# EAGLE board ADCS Motherboard (EAGLE 9.6.2)
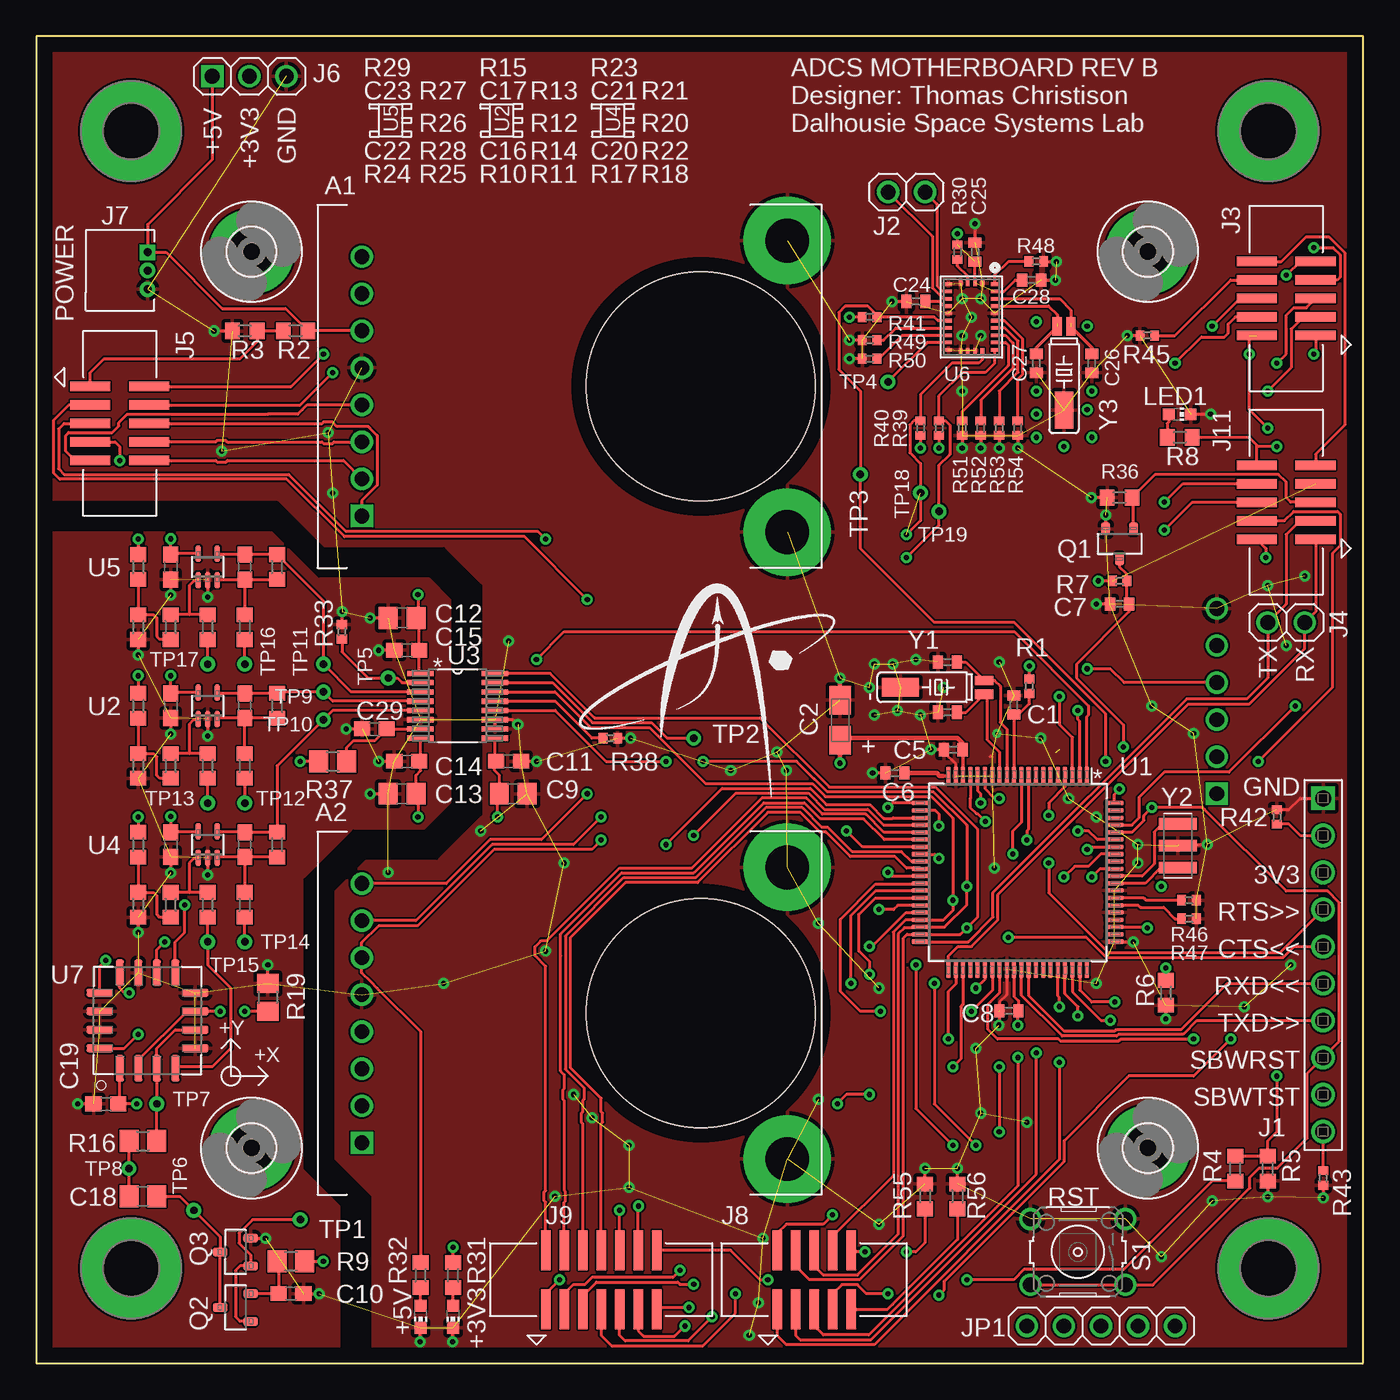
[diagram p4: board, top side]
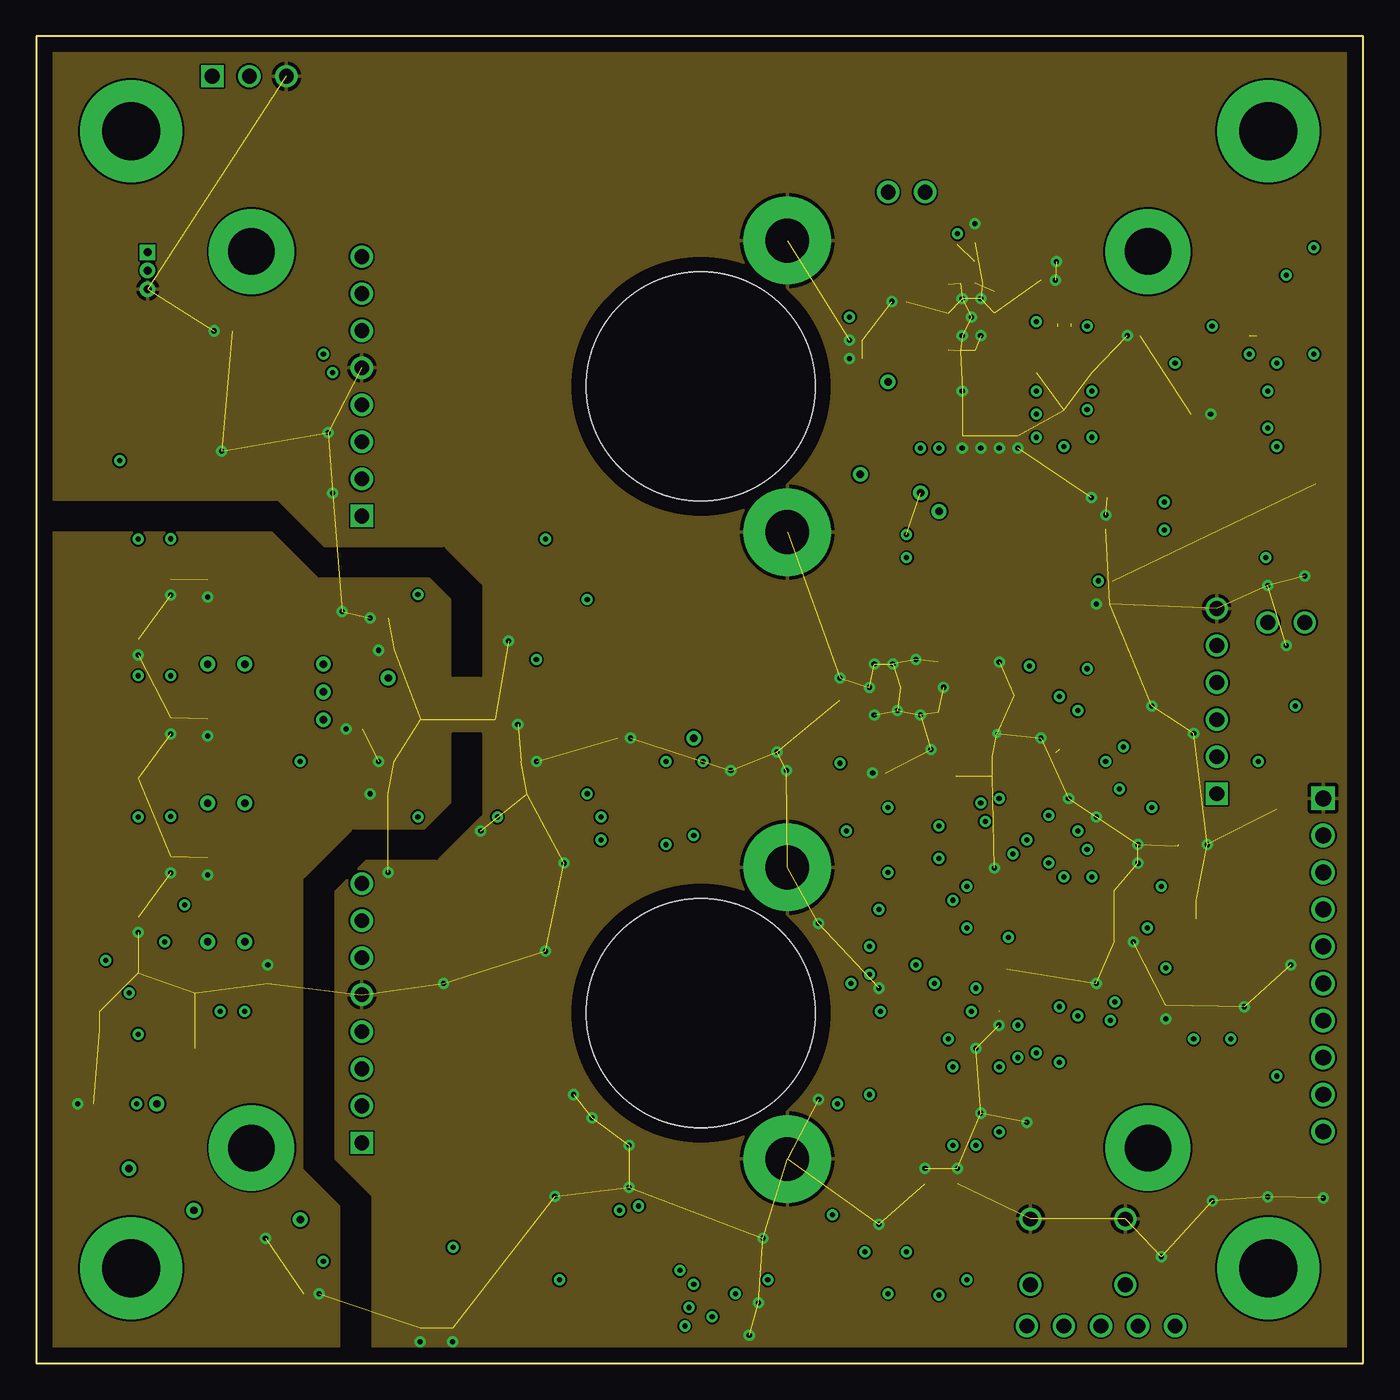
[diagram p5: board, inner layer GND]
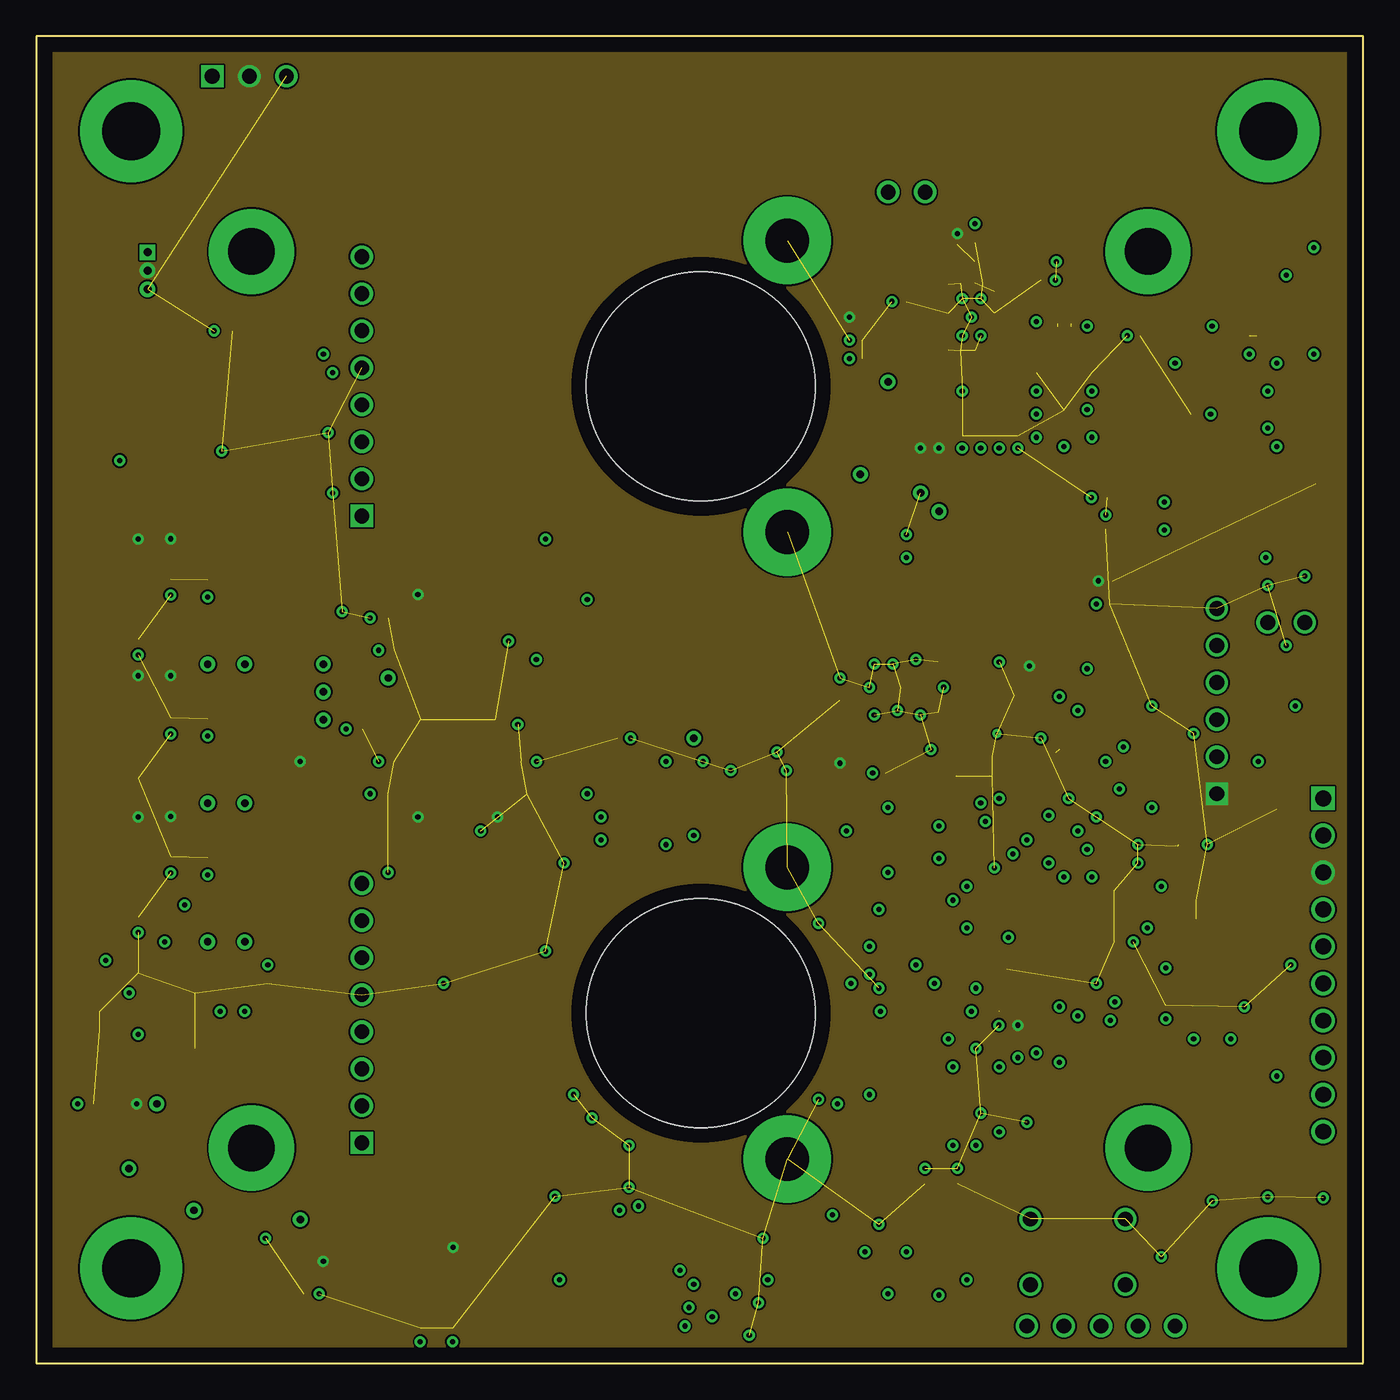
[diagram p6: board, inner layer PWR]
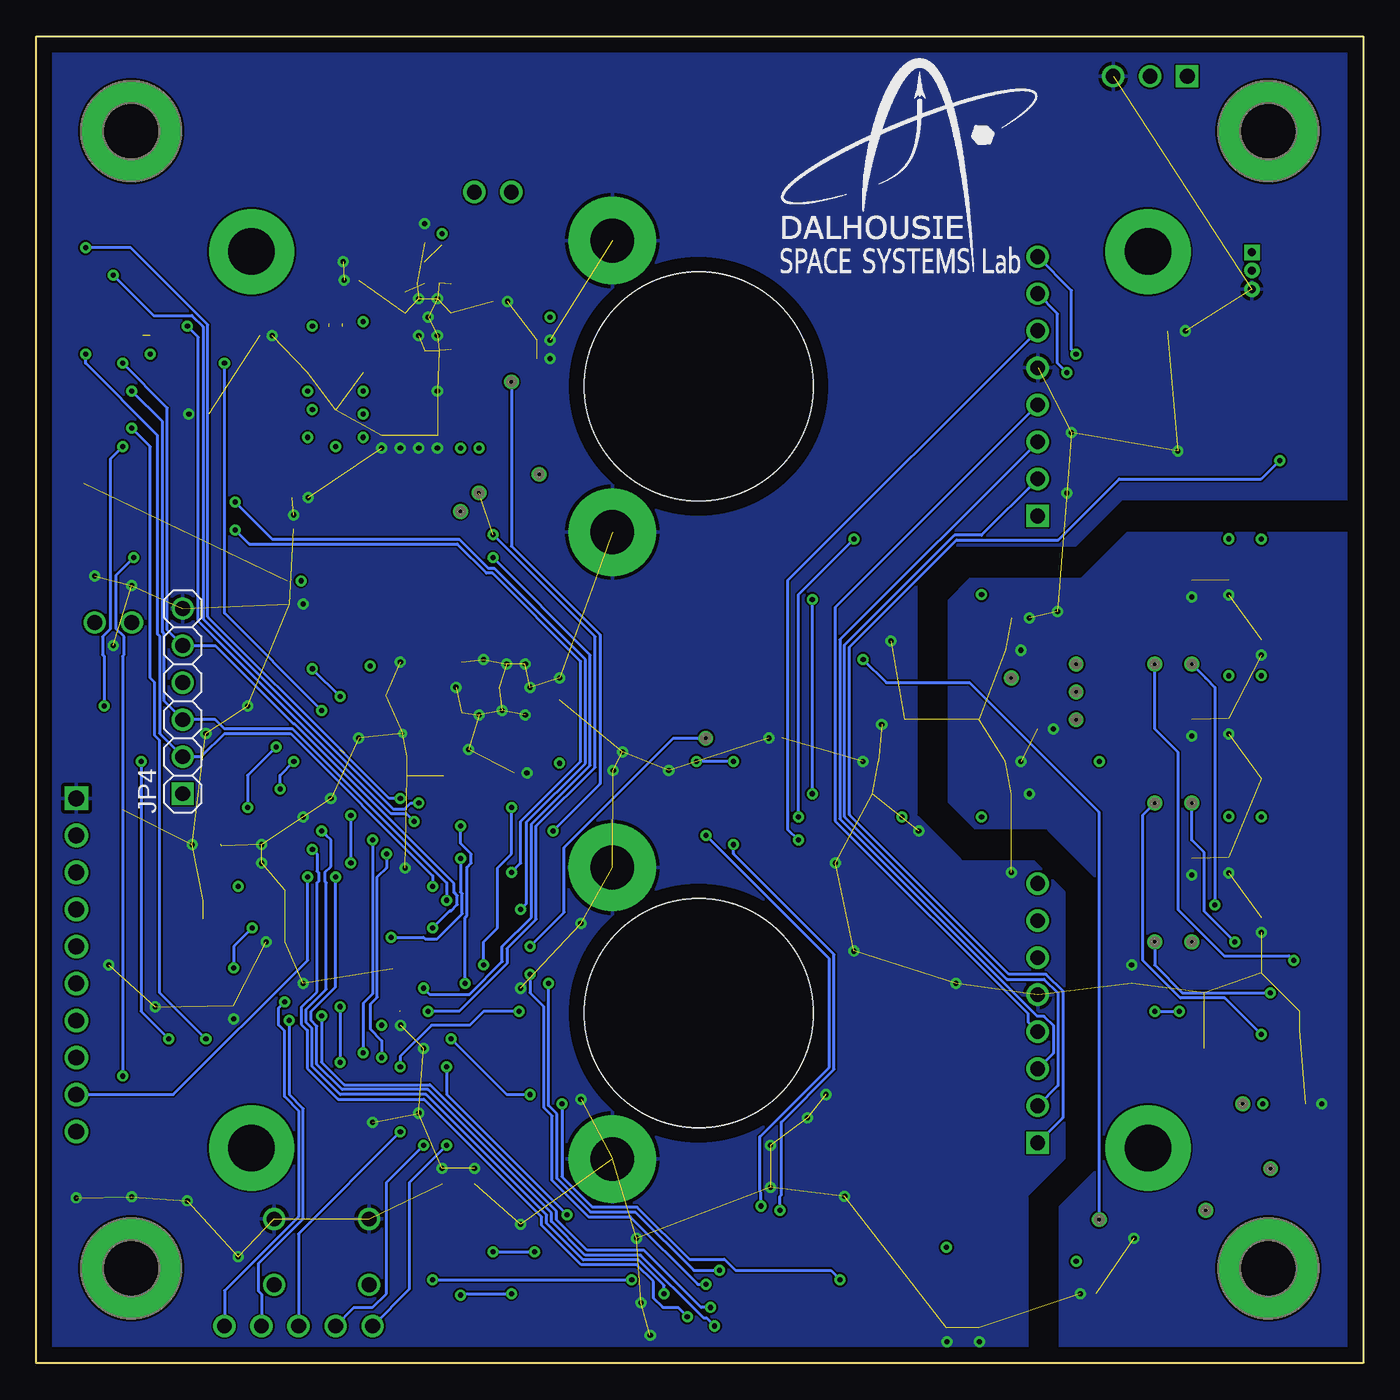
[diagram p7: board, bottom side, seen from below]

Size 91 x 91 mm. Coordinates in mm from the lower left corner, seen from the top.
Outline: 0,0 91,0 91,91 0,91 0,0
Copper layers (1+2*15+16): Top 0.035mm / dielectric 0.2mm / GND 0.035mm / dielectric 1.03mm / PWR 0.035mm / dielectric 0.2mm / Bottom 0.035mm
Design rules "default *": minimum track width 6mil, minimum drill 0.2mm, track to track 5mil, track to pad 0.2mm, pad to pad 5mil, via to via 0.54mm, smd to smd 6mil, copper to edge 40mil, drill to drill 0.54mm, minimum pad ring 10mil, minimum via ring 8mil, stop-mask expansion 4mil, vias tented up to drill 0mil, thermal gap 10mil
Net classes: 1 Ground: width 0.203 mm, drill 0.305 mm, clearance 0.152 mm to class 0, clearance 0.152 mm; 2 Power: width 0.203 mm, drill 0.305 mm, clearance 0.152 mm to class 0, clearance 0.152 mm to class 1, clearance 0.152 mm

## Footprints (pad centres in the part's own frame; a part is rotated, then mirrored left to right if it is on the bottom)
ARDUCAM = drill 1.016 square: 1 -29.18,-18.89 | drill 1.016: 2 -29.18,-16.35; 3 -29.18,-13.81; 4 -29.18,-11.27; 5 -29.18,-8.73; 6 -29.18,-6.19; 7 -29.18,-3.65; 8 -29.18,-1.11 | drill 3 pad 6: P$1 0,0; P$2 0,-20 | hole 15.7: -5.917,-10
C0402 = smd 0.7 x 0.9: 1 -0.65,0; 2 0.65,0
A/3216-18R = smd 1.95 x 1.5: + 1.375,0; - -1.375,0
C0805 = smd 1.3 x 1.5: 1 -0.95,0; 2 0.95,0
C0603 = smd 1.1 x 1: 1 -0.85,0; 2 0.85,0
3,2-PAD = drill 3.2 pad 5.842: B3,2 0,0
HDRV10W66P254_10X1_2540X254H858 = drill 1.08 pad 1.62 square: 1 0,0 | drill 1.08 pad 1.62: 2 2.54,0; 3 5.08,0; 4 7.62,0; 5 10.16,0; 6 12.7,0; 7 15.24,0; 8 17.78,0; 9 20.32,0; 10 22.86,0
1X02 = drill 1.016: 1 -1.27,0; 2 1.27,0
CNC_3221-10-0300-00 = smd 0.65 x 2.76: 1 -2.54,-2.02; 2 -2.54,2.02; 3 -1.27,-2.02; 4 -1.27,2.02; 5 0,-2.02; 6 0,2.02; 7 1.27,-2.02; 8 1.27,2.02; 9 2.54,-2.02; 10 2.54,2.02
1X03 = drill 1.016 square: 1 -2.54,0 | drill 1.016: 2 0,0; 3 2.54,0
TE-1734829-3 = drill 0.55 square: 1 0,0 | drill 0.55: 2 -1.25,0; 3 -2.54,0
CNC_3221-14-0300-00 = smd 0.65 x 2.76: 1 -3.81,-2.02; 2 -3.81,2.02; 3 -2.54,-2.02; 4 -2.54,2.02; 5 -1.27,-2.02; 6 -1.27,2.02; 7 0,-2.02; 8 0,2.02; 9 1.27,-2.02; 10 1.27,2.02; 11 2.54,-2.02; 12 2.54,2.02; 13 3.81,-2.02; 14 3.81,2.02
1X05 = drill 1.016: 1 -5.08,0; 2 -2.54,0; 3 0,0; 4 2.54,0; 5 5.08,0
1X06 = drill 1.016 square: 1 -6.35,0 | drill 1.016: 2 -3.81,0; 3 -1.27,0; 4 1.27,0; 5 3.81,0; 6 6.35,0
CHIP-LED0603 = smd 0.8 x 0.8: A 0,-0.75; C 0,0.75
MTGP700H400 = drill 4 pad 7: 1 0,0
SOT23-3P95_230X110L20X43N_PMV16XN = smd 0.61 x 0.87: 1 -0.95,-1.02; 2 0.95,-1.02; 3 0,1.02
SOT23-3P95_237X112L25X40N_MICRO3 = smd 0.61 x 0.98: 1 -0.95,-1.035; 2 0.95,-1.035; 3 0,1.035
R0402 = smd 0.6 x 0.7: 1 -0.5,0; 2 0.5,0
R0603 = smd 1 x 1.1: 1 -0.85,0; 2 0.85,0
R0805 = smd 1.3 x 1.5: 1 -0.95,0; 2 0.95,0
B3F-10XX = drill 1.016: 1 -3.251,2.261; 2 3.251,2.261; 3 -3.251,-2.261; 4 3.251,-2.261
TP_P76H50 = drill 0.51 pad 0.762: 1 0,0
QFP80P50_1400X1400X160L60X22N = smd 0.3 x 1.26: 1 -4.75,-6.63; 2 -4.25,-6.63; 3 -3.75,-6.63; 4 -3.25,-6.63; 5 -2.75,-6.63; 6 -2.25,-6.63; 7 -1.75,-6.63; 8 -1.25,-6.63; 9 -0.75,-6.63; 10 -0.25,-6.63; 11 0.25,-6.63; 12 0.75,-6.63; 13 1.25,-6.63; 14 1.75,-6.63; 15 2.25,-6.63; 16 2.75,-6.63; 17 3.25,-6.63; 18 3.75,-6.63; 19 4.25,-6.63; 20 4.75,-6.63; 41 4.75,6.63; 42 4.25,6.63; 43 3.75,6.63; 44 3.25,6.63; 45 2.75,6.63; 46 2.25,6.63; 47 1.75,6.63; 48 1.25,6.63; 49 0.75,6.63; 50 0.25,6.63; 51 -0.25,6.63; 52 -0.75,6.63; 53 -1.25,6.63; 54 -1.75,6.63; 55 -2.25,6.63; 56 -2.75,6.63; 57 -3.25,6.63; 58 -3.75,6.63; 59 -4.25,6.63; 60 -4.75,6.63 | smd 1.26 x 0.3: 21 6.63,-4.75; 22 6.63,-4.25; 23 6.63,-3.75; 24 6.63,-3.25; 25 6.63,-2.75; 26 6.63,-2.25; 27 6.63,-1.75; 28 6.63,-1.25; 29 6.63,-0.75; 30 6.63,-0.25; 31 6.63,0.25; 32 6.63,0.75; 33 6.63,1.25; 34 6.63,1.75; 35 6.63,2.25; 36 6.63,2.75; 37 6.63,3.25; 38 6.63,3.75; 39 6.63,4.25; 40 6.63,4.75; 61 -6.63,4.75; 62 -6.63,4.25; 63 -6.63,3.75; 64 -6.63,3.25; 65 -6.63,2.75; 66 -6.63,2.25; 67 -6.63,1.75; 68 -6.63,1.25; 69 -6.63,0.75; 70 -6.63,0.25; 71 -6.63,-0.25; 72 -6.63,-0.75; 73 -6.63,-1.25; 74 -6.63,-1.75; 75 -6.63,-2.25; 76 -6.63,-2.75; 77 -6.63,-3.25; 78 -6.63,-3.75; 79 -6.63,-4.25; 80 -6.63,-4.75
SC70-5P65_210X110L36X22N = smd 0.38 x 1.09: 1 -0.65,-0.91; 2 0,-0.91; 3 0.65,-0.91; 4 0.65,0.91; 5 -0.65,0.91
DBQ16 = smd 1.803 x 0.356: 1 -2.553,2.223; 2 -2.553,1.587; 3 -2.553,0.953; 4 -2.553,0.318; 5 -2.553,-0.318; 6 -2.553,-0.953; 7 -2.553,-1.587; 8 -2.553,-2.223; 9 2.553,-2.223; 10 2.553,-1.587; 11 2.553,-0.953; 12 2.553,-0.318; 13 2.553,0.318; 14 2.553,0.953; 15 2.553,1.587; 16 2.553,2.223
BNO055 = smd 0.25 x 0.475: 1 -2.25,1.562; 6 -2.25,-1.562; 7 -1.75,-1.562; 8 -1.25,-1.562; 9 -0.75,-1.562; 10 -0.25,-1.562; 11 0.25,-1.562; 12 0.75,-1.562; 13 1.25,-1.562; 14 1.75,-1.562; 15 2.25,-1.562; 20 2.25,1.562; 21 1.75,1.562; 22 1.25,1.562; 23 0.75,1.562; 24 0.25,1.562; 25 -0.25,1.562; 26 -0.75,1.562; 27 -1.25,1.562; 28 -1.75,1.562 | smd 0.375 x 0.25: 2 -2.312,0.75; 3 -2.312,0.25; 4 -2.312,-0.25; 5 -2.312,-0.75; 16 2.312,-0.75; 17 2.312,-0.25; 18 2.312,0.25; 19 2.312,0.75
LCCS16P127_736X736X279L127X50N = smd 0.56 x 1.83: 1 -1.905,-3.275; 2 -0.635,-3.275; 3 0.635,-3.275; 4 1.905,-3.275; 9 1.905,3.275; 10 0.635,3.275; 11 -0.635,3.275; 12 -1.905,3.275 | smd 1.83 x 0.56: 5 3.275,-1.905; 6 3.275,-0.635; 7 3.275,0.635; 8 3.275,1.905; 13 -3.275,1.905; 14 -3.275,0.635; 15 -3.275,-0.635; 16 -3.275,-1.905
MS3V-T1R = smd 0.635 x 1.27: P1 -0.47,-4.43; P2 0.47,-4.43 | smd 1.27 x 2.54: P3 0,1.3
MURATA-FILTER_CSTCR = smd 0.8 x 2.6: 1 -1.5,0; 2 0,0; 3 1.5,0

## Placement (x,y rotation side)
A1  ARDUCAM_OV5642  [ARDUCAM]  51.5,77 0 top
A2  ARDUCAM_OV5642  [ARDUCAM]  51.5,34 0 top
C1  100n  [C0402]  67.04,45.14 90 top
C2  10u  [A/3216-18R]  55.13,44.09 270 top
C3  12p  [C0402]  62.5,48.08 0 top
C4  12p  [C0402]  62.5,44.64 0 top
C5  100n  [C0402]  62.89,42.08 0 top
C6  470n  [C0402]  58.89,40.47 0 top
C7  1n  [C0402]  74.3,52.07 180 top
C8  100n  [C0402]  66.71,24.17 180 top
C9  1u  [C0805]  32.7,39.05 0 top
C10  1u  [C0603]  17.46,4.76 180 top
C11  0.1u  [C0603]  32.38,41.27 0 top
C12  1u  [C0805]  25.08,51.12 180 top
C13  1u  [C0805]  25.08,39.05 180 top
C14  0.1u  [C0603]  25.4,41.27 180 top
C15  0.1u  [C0603]  25.4,48.9 180 top
C16  0.1u  [C0603]  9.21,45.09 270 top
C17  1n  [C0603]  14.29,45.09 90 top
C18  0.1u  [C0805]  7.3,11.43 180 top
C19  0.1u  [C0603]  4.76,17.78 180 top
C20  0.1u  [C0603]  9.21,35.56 270 top
C21  1n  [C0603]  14.29,35.56 90 top
C22  0.1u  [C0603]  9.21,54.61 270 top
C23  1n  [C0603]  14.29,54.61 90 top
C24  1u  [C0402]  60.33,72.82 0 top
C25  0.1u  [C0402]  64.39,76.2 270 top
C26  22p  [C0402]  72.39,68.58 90 top
C27  22p  [C0402]  68.58,68.58 90 top
C28  0.1u  [C0402]  68.26,74.3 180 top
C29  0.1u  [C0603]  23.18,43.5 180 top
H1  MOUNT-PAD-ROUND3.2  [3,2-PAD]  14.75,76.25 0 top
H2  MOUNT-PAD-ROUND3.2  [3,2-PAD]  76.25,76.25 0 top
H3  MOUNT-PAD-ROUND3.2  [3,2-PAD]  76.25,14.75 0 top
H4  MOUNT-PAD-ROUND3.2  [3,2-PAD]  14.75,14.75 0 top
J1  HDR_10_EZFET_DEBUGGER  [HDRV10W66P254_10X1_2540X254H858]  88.27,38.73 270 top
J2  [1X02]  59.69,80.33 180 top
J3  CNC_3221-10-0300-00  [CNC_3221-10-0300-00]  85.72,73.03 90 top
J4  [1X02]  85.72,50.8 0 top
J5  CNC_3221-10-0300-00  [CNC_3221-10-0300-00]  5.71,64.45 270 top
J6  [1X03]  14.61,88.27 0 top
J7  TE-1734829-3  [TE-1734829-3]  7.62,76.2 90 top
J8  CNC_3221-10-0300-00  [CNC_3221-10-0300-00]  53.34,5.71 0 top
J9  CNC_3221-14-0300-00  [CNC_3221-14-0300-00]  38.73,5.71 0 top
J11  CNC_3221-10-0300-00  [CNC_3221-10-0300-00]  85.72,59.05 90 top
JP1  [1X05]  73.03,2.54 0 top
JP4  [1X06]  80.96,45.4 90 bottom
LED1  [CHIP-LED0603]  78.42,65.09 270 top
LED2  [CHIP-LED0603]  28.57,3.17 180 top
LED3  [CHIP-LED0603]  26.35,3.17 180 top
MH1  MTGP700H400  [MTGP700H400]  6.5,6.5 0 top
MH2  MTGP700H400  [MTGP700H400]  84.5,6.5 0 top
MH3  MTGP700H400  [MTGP700H400]  84.5,84.5 0 top
MH4  MTGP700H400  [MTGP700H400]  6.5,84.5 0 top
Q1  PMV16XN  [SOT23-3P95_230X110L20X43N_PMV16XN]  74.3,56.2 180 top
Q2  IRLML6246TRPBF  [SOT23-3P95_237X112L25X40N_MICRO3]  13.65,3.81 90 top
Q3  IRLML2246TRPBF  [SOT23-3P95_237X112L25X40N_MICRO3]  13.65,7.62 90 top
R1  0R  [R0402]  68.11,46.43 90 top
R2  1k  [R0603]  17.78,70.8 0 top
R3  2k  [R0603]  14.29,70.8 0 top
R4  1k  [R0603]  82.23,13.34 270 top
R5  2k  [R0603]  84.45,13.34 90 top
R6  1M  [R0603]  77.47,25.4 90 top
R7  47k  [R0402]  74.3,53.66 180 top
R8  470R  [R0603]  78.42,63.5 180 top
R9  200R  [R0805]  17.46,6.99 0 top
R10  1k  [R0603]  6.99,45.09 270 top
R11  1k  [R0603]  6.99,40.96 270 top
R12  5.6k  [R0603]  11.75,40.96 270 top
R13  5.6k  [R0603]  14.29,40.96 270 top
R14  1.37M  [R0603]  9.21,40.96 90 top
R15  1.37M  [R0603]  16.51,45.09 270 top
R16  1R  [R0805]  7.3,15.24 0 top
R17  1k  [R0603]  6.99,35.56 270 top
R18  1k  [R0603]  6.99,31.43 270 top
R19  5.1M  [R0805]  15.88,25.08 270 top
R20  5.6k  [R0603]  11.75,31.43 270 top
R21  5.6k  [R0603]  14.29,31.43 270 top
R22  1.37M  [R0603]  9.21,31.43 90 top
R23  1.37M  [R0603]  16.51,35.56 270 top
R24  1k  [R0603]  6.99,54.61 270 top
R25  1k  [R0603]  6.99,50.48 270 top
R26  5.6k  [R0603]  11.75,50.48 270 top
R27  5.6k  [R0603]  14.29,50.48 270 top
R28  1.37M  [R0603]  9.21,50.48 90 top
R29  1.37M  [R0603]  16.51,54.61 270 top
R30  10k  [R0402]  63.18,76.2 90 top
R31  470R  [R0603]  28.57,6.03 270 top
R32  750R  [R0603]  26.35,6.03 270 top
R33  5.1M  [R0402]  20.95,50.16 270 top
R36  10k  [R0603]  74.3,59.37 0 top
R37  10k  [R0805]  20.32,41.27 0 top
R38  5.1M  [R0402]  39.37,42.86 180 top
R39  10k  [R0402]  61.91,64.14 270 top
R40  10k  [R0402]  60.64,64.14 270 top
R41  10k  [R0402]  57.15,71.75 180 top
R42  5.1M  [R0402]  85.09,37.47 90 top
R43  5.1M  [R0402]  88.27,12.7 270 top
R45  5.1M  [R0402]  76.2,70.48 180 top
R46  5.1M  [R0402]  79.06,31.75 0 top
R47  5.1M  [R0402]  79.06,30.48 0 top
R48  5.1M  [R0402]  68.58,75.56 180 top
R49  5.1M  [R0402]  57.15,70.17 0 top
R50  5.1M  [R0402]  57.15,68.9 0 top
R51  5.1M  [R0402]  63.5,64.14 90 top
R52  5.1M  [R0402]  64.77,64.14 90 top
R53  5.1M  [R0402]  66.04,64.14 90 top
R54  5.1M  [R0402]  67.31,64.14 90 top
R55  5.1M  [R0603]  60.96,11.43 90 top
R56  5.1M  [R0603]  63.18,11.43 270 top
S1  RST  [B3F-10XX]  71.44,7.62 180 top
TP1  TESTPOINT  [TP_P76H50]  18.1,9.84 90 top
TP2  TESTPOINT  [TP_P76H50]  45.09,42.86 270 top
TP3  TESTPOINT  [TP_P76H50]  56.52,60.96 90 top
TP4  TESTPOINT  [TP_P76H50]  58.42,67.31 90 top
TP5  TESTPOINT  [TP_P76H50]  24.13,46.99 0 top
TP6  TESTPOINT  [TP_P76H50]  10.79,10.48 0 top
TP7  TESTPOINT  [TP_P76H50]  8.26,17.78 0 top
TP8  TESTPOINT  [TP_P76H50]  6.35,13.34 0 top
TP9  TESTPOINT  [TP_P76H50]  19.68,46.04 0 top
TP10  TESTPOINT  [TP_P76H50]  19.68,44.13 0 top
TP11  TESTPOINT  [TP_P76H50]  19.68,47.94 0 top
TP12  TESTPOINT  [TP_P76H50]  14.29,38.42 0 top
TP13  TESTPOINT  [TP_P76H50]  11.75,38.42 0 top
TP14  TESTPOINT  [TP_P76H50]  14.29,28.89 0 top
TP15  TESTPOINT  [TP_P76H50]  11.75,28.89 0 top
TP16  TESTPOINT  [TP_P76H50]  14.29,47.94 0 top
TP17  TESTPOINT  [TP_P76H50]  11.75,47.94 0 top
TP18  TESTPOINT  [TP_P76H50]  60.64,59.69 0 top
TP19  TESTPOINT  [TP_P76H50]  61.91,58.42 0 top
U1  MSP430F5529IPN  [QFP80P50_1400X1400X160L60X22N]  67.31,33.66 180 top
U2  LMV321  [SC70-5P65_210X110L36X22N]  11.75,45.09 0 top
U3  ADS7841E_2K5  [DBQ16]  28.89,45.09 0 top
U4  LMV321  [SC70-5P65_210X110L36X22N]  11.75,35.56 0 top
U5  LMV321  [SC70-5P65_210X110L36X22N]  11.75,54.61 0 top
U6  [BNO055]  64.14,71.75 270 top
U7  HMC1053  [LCCS16P127_736X736X279L127X50N]  7.62,23.5 0 top
Y1  32.768kHz  [MS3V-T1R]  60.58,46.35 90 top
Y2  CSTCR4M00G15L99  [MURATA-FILTER_CSTCR]  78.3,35.48 270 top
Y3  32.768kHz  [MS3V-T1R]  70.48,66.67 180 top

## Tracks (layer width: path | path; a pad name or v marks a point on that pad's centre or on a via)
!CS!_CURR_SENSE_MTQR  (via drill 0.35)
  Top 0.203: J8.5 53.34,2.56 53.98,1.93 57.09,1.93 67.31,12.15 v67.31,20.95 | v66.99,34.92 66.99,36.51 67.56,37.08 U1.10
  Bottom 0.203: v66.99,34.92 66.99,33.97 67.61,33.35 67.61,25.09 68.07,24.64 68.07,22.87 67.31,22.11 v67.31,20.95
!CS!_CURR_SENSE_RW  (via drill 0.35)
  Top 0.203: J8.3 52.07,1.91 52.38,1.6 57.23,1.6 68.58,12.95 v68.58,21.27 | v67.94,35.88 67.94,36.51 68.06,36.63 U1.9
  Bottom 0.203: v67.94,35.88 67.94,25.32 68.58,24.68 v68.58,21.27
!CS!_HMC1053  (via drill 0.35)
  Top 0.203: v57.15,28.57 57.32,28.57 59.65,30.91 U1.36 | TP2.1 43.25,42.86 42.19,43.93 38.14,43.93 35.39,46.67 U3.15
  Bottom 0.203: v57.15,28.57 54.8,30.92 54.8,35.37 47.31,42.86 TP2.1
!CS!_SUN_X+  (via drill 0.35)  (1 unrouted)
  Top 0.203: U1.48 66.06,25.39 65.28,24.61 65.28,22.87 65.93,22.23 70.1,22.23 70.22,22.1 74.24,22.1 74.36,22.23 v79.38,22.23 | 83.19,70.48 v83.19,69.22 83.19,65.41 v84.45,64.14
  Bottom 0.203: v79.38,22.23 82.55,25.4 82.55,42.71 82.89,43.06 82.89,46.7 83.19,46.99 83.19,62.87 v84.45,64.14
!CS!_SUN_X-  (via drill 0.35)  (1 unrouted)
  Top 0.203: 65.01,40.24 U1.15 65.06,39.4 65.72,38.73 v66.04,38.73 | v87.63,76.52 88.92,76.52 89.43,76.02 89.43,74.5 89.22,74.3 J3.7
  Bottom 0.203: 66.67,38.73 v66.04,38.73 66.8,38.73 70.17,42.11 | 69.91,41.85 79.24,51.18 79.24,71.22 84.54,76.52 v87.63,76.52
!CS!_SUN_Y+  (via drill 0.35)
  Top 0.203: U1.2 71.56,44.01 71.44,44.13 v71.44,44.77 | v78.11,68.58 79.91,70.39 81.5,70.39 81.76,70.64 81.76,71.28 82.23,71.75 J3.4
  Bottom 0.203: v78.11,68.58 78.11,51.44 v71.44,44.77
!CS!_SUN_Y-  (via drill 0.35)
  Top 0.203: U1.16 64.56,39.26 64.77,39.05 v64.77,38.42 | v85.72,74.61 86.68,75.56 J3.9
  Bottom 0.203: v64.77,38.42 65.32,38.42 65.74,38 66.53,38 79.57,51.04 79.57,71.08 80.34,71.85 82.97,71.85 v85.72,74.61
!CS!_SUN_Z+  (via drill 0.35)
  Top 0.203: U1.3 71.06,42.92 70.17,43.81 v70.17,45.72 | v72.07,47.62 73.66,47.62 74.61,46.67 JP4.4
  Bottom 0.203: v72.07,47.62 v70.17,45.72
!CS!_SUN_Z-  (via drill 0.35)
  Top 0.203: J3.6 82.55,73.03 v80.64,71.12 | U1.17 64.06,38.74 64.04,38.72 64.04,38.11 64.47,37.68 64.55,37.68 v65.09,37.15
  Bottom 0.203: v65.09,37.15 65.61,37.67 66.67,37.67 79.9,50.91 79.9,70.37 v80.64,71.12
+3V3  (via drill 0.35)  (3 unrouted)
  Top 0.203: U2.5 9.27,45.99 C16.1 v9.21,47.15 | v6.99,37.47 R17.1 | v6.99,56.52 R24.1 | U5.5 9.25,55.52 9.21,55.56 C22.1 v9.21,56.54 | U3.8 26.34,41.37 C14.1 26.35,41.17 26.35,40.64 26.03,40.32 C13.1 26.16,38.92 v26.16,37.47 | v6.99,47.15 R10.1 | R9.2 v19.68,6.99 | R1.2 v68.11,47.81 | U3.1 26.25,47.4 C15.1 26.25,50.9 C12.1 26.16,51.25 v26.16,52.7 | C2.+ 55.13,42.6 | C8.1 67.36,24.84 67.06,25.15 U1.50 | U3.9 31.45,41.37 C11.1 31.43,41.17 31.43,40.64 31.75,40.32 C9.1 31.62,38.92 v31.62,37.47 | v9.21,37.49 C20.1 9.27,36.47 U4.5 | v67.33,23.18 67.33,24.11 67.31,24.13 | R7.2 v72.86,53.66 | C28.2 67.15,74.3 66.36,73.5 U6.28 | U6.3 C25.2 | v6.88,17.78 C19.1 5.71,17.88 U7.1 | R40.2 v60.64,62.75 | R39.2 v61.91,62.75 | R41.2 v55.77,71.75 | R30.2 v63.18,77.47 | R37.1 v18.09,41.27 | 28.68,6.99 R31.1 v28.57,7.94
  Top 0.254: C8.1 67.31,24.13 67.36,24.13 | 63.56,42.06 63.56,42.26 | U1.18 63.56,42.01
  Top 0.305: 63.56,42.06 C5.2 | 63.56,42.01 C5.2 | 55.13,42.6 v55.13,41.15 | C5.2 63.54,42.51 63.17,42.88 55.29,42.88 C2.+
  pour PWR (rank 6, no thermals): -4.45,93.98 -4.45,-3.81 95.25,-3.81 95.25,92.71 95.25,93.98
+5V  (via drill 0.35)
  Top 0.203: A1.6 18.94,70.81 | 18.94,70.81 R2.2 | R2.2 18.63,71.12 | 18.63,71.12 18.63,71.22 | 18.94,70.81 18.63,71.12 | J6.1 12.06,82.55 7.62,78.11 J7.1 8.89,76.2 12.75,72.34 17.09,72.34 R2.2 | v38.73,35.88 38.1,35.24 31.39,35.24 26.17,30.02 23.49,30.02 22.32,28.85 A2.6 22.32,26.77 22.96,26.14 23.38,25.71 26.35,22.74 R32.1
  Bottom 0.203: v38.73,35.88 39.47,36.61 39.47,53.66 A1.6
ACT_BRD_3V_PRESENT  (via drill 0.35)
  Top 0.203: J11.4 85.61,57.78 86.24,58.41 89.25,58.41 89.43,58.23 89.43,56.06 88.9,55.54 88.9,46.35 v83.82,41.27 | v81.92,22.23 79.38,19.68 74.93,19.68 70.5,15.25 70.5,13.83 62.28,5.62 62.28,5.03 v61.91,4.66 | J8.7 54.61,4.74 55.25,5.38 56.33,5.38 56.94,4.76 v58.42,4.76
  Bottom 0.203: v83.82,41.27 83.82,24.13 v81.92,22.23 | v61.91,4.66 61.91,4.76 v58.42,4.76
ACT_BRD_5V_PRESENT  (via drill 0.35)
  Top 0.203: J9.14 47.62,7.74 49.65,5.71 v50.16,5.71 | R4.2 80.64,12.48 74.58,6.42 67.75,6.42 67.04,5.71 v63.82,5.71
  Bottom 0.203: v63.82,5.71 v50.16,5.71
ACT_BRD_5V_SHIFTED  (via drill 0.35)
  Top 0.203: v85.09,19.68 85.09,15.88 84.45,15.24 R5.2 R4.1 | J11.2 84.34,55.88 v84.34,55.24
  Bottom 0.203: v84.34,55.24 85.52,54.07 85.52,50.36 84.99,49.83 84.99,48.59 85.09,48.49 v85.09,19.68
AVCC1
  Top 0.203: R1.1 68.12,45.77 68.12,45.24 67.37,44.49 C1.1 67.04,40.3 U1.11
B_MEAS_X
  Top 0.203: U4.4 13.94,36.47 13.98,36.43 C21.2 R23.1 16.51,40.96 TP10.1 20.32,44.77 U3.5
B_MEAS_Y
  Top 0.203: U2.4 12.46,45.94 C17.2 R15.1 16.61,46.04 TP9.1 20.32,45.4 U3.4
B_MEAS_Z
  Top 0.203: U5.4 12.41,55.53 12.48,55.46 C23.2 R29.1 19.68,52.28 TP11.1 21.59,46.04 U3.3
BNO055_INT  (via drill 0.35)
  Top 0.203: U6.14 61.12,70 TP4.1 | U1.27 56.67,35.41 v55.56,36.51
  Bottom 0.203: v55.56,36.51 52.35,39.73 52.35,49.96 58.42,56.03 TP4.1
BNO055_RST  (via drill 0.35)
  Top 0.203: 57.78,71.75 61.59,71.75 61.84,71.5 U6.11 | v74.3,39.37 73.94,39.02 U1.80 | v73.34,41.27 73.34,44.53 67.08,50.8 61.59,50.8 56.52,55.88 TP3.1 56.52,66.67 55.04,68.15 55.04,72.06 55.47,72.49 57.05,72.49 57.78,71.75 | R41.1 57.78,71.75
  Bottom 0.203: v74.3,39.37 74.3,40.32 v73.34,41.27
CAM_5V_PRESENT
  Top 0.203: R2.1 R3.2 15.14,70.06 13.97,68.9 4.65,68.9 3.69,67.94 J5.1
CAMERA-1_CS
  Top 0.203: A1.1 22.32,59.15 23.38,60.21 23.38,63.63 22.87,64.14 22.76,64.25 20.6,64.25 20.31,64.55 19.7,64.55 19.6,64.45 J5.6
  Bottom 0.203: 22.22,58.11 A1.1
CAMERA-1_SCL  (via drill 0.35)
  Top 0.203: v19.68,69.22 17.46,66.99 J5.2
  Bottom 0.203: v19.68,69.22 20,69.53 20,73.57 A1.8
CAMERA-1_SDA  (via drill 0.35)
  Top 0.203: J5.4 18.1,65.72 v20.32,67.94
  Bottom 0.203: v20.32,67.94 20.95,68.58 20.95,71.98 A1.7
CAMERA-2_CS  (via drill 0.35)
  Top 0.203: v5.71,61.91 5.71,62.87 5.4,63.18 J5.7
  Bottom 0.203: v5.71,61.91 6.99,60.64 16.72,60.64 20.9,56.46 27.89,56.46 35.23,49.12 35.23,37.6 24.29,26.66 21.74,26.66 20.6,25.52 20.6,16.83 A2.1
CAMERA-2_SCL  (via drill 0.35)
  Top 0.203: J5.3 2.22,65.72 1.19,64.69 1.19,61.04 1.6,60.63 17.18,60.63 21.12,56.68 33.49,56.68 v37.78,52.39 | A2.8 28.11,32.89 31.12,35.9 34.63,35.9 v37.78,39.05
  Bottom 0.203: v37.78,39.05 v37.78,52.39
CAMERA-2_SDA  (via drill 0.35)
  Top 0.203: A2.7 26.04,30.35 31.26,35.57 36.84,35.57 v38.73,37.47 | 3.69,64.22 J5.5 1.91,64.45 1.52,64.07 1.52,61.34 1.91,60.96 17.31,60.96 21.23,57.05 34.39,57.05 v34.92,56.52
  Bottom 0.203: v38.73,37.47 38.73,52.7 v34.92,56.52
CAMERA_MISO
  Top 0.203: J5.8 7.74,63.19 12.3,63.19 12.4,63.28 13,63.28 13.1,63.19 19.59,63.19 19.7,63.08 20.31,63.08 20.41,63.19 A1.3
  Bottom 0.203: A1.3 35.89,49.62 35.89,37.33 22.36,23.79 21.88,23.79 21.26,23.17 21.26,21.25 A2.3
CAMERA_MOSI
  Top 0.203: J5.10 12.3,61.91 12.4,61.81 13,61.81 13.1,61.91 21.06,61.91 A1.2
  Bottom 0.203: A1.2 26.18,56.79 28.02,56.79 35.56,49.26 35.56,37.47 24.43,26.33 21.88,26.33 20.93,25.38 20.93,19.04 A2.2
CAMERA_SCLK
  Top 0.203: J5.9 2.65,61.91 2.01,62.55 2.01,63.63 2.21,63.83 5.2,63.83 5.66,64.28 5.66,64.51 6.23,65.08 15.56,65.08 15.88,65.08 17.92,65.08 18.23,65.39 18.57,65.73 A1.4
  Bottom 0.203: A2.4 22.97,23.38 22.97,23.94 36.22,37.19 36.22,51.83 A1.4
GND  (via drill 0.2, 0.35)  (152 unrouted)
  Top 0.203: C16.2 v9.21,43.15 | C20.2 v9.21,33.63 | R18.2 v6.99,29.53 | C22.2 v9.21,52.68 | R25.2 v6.99,48.58 | U1.19 63.06,41.08 62.24,41.9 C5.1 | C14.2 v23.47,41.27 | v34.32,41.27 C11.2 | C15.2 v23.47,48.9 | C13.2 23.52,39.05 v22.89,39.05 | C12.2 v22.89,51.12 | 78.37,35.56 v80.33,35.56 | U1.61 75.23,28.91 v75.25,28.89 | C19.2 v2.83,17.78 | C10.1 v19.39,4.76 | R19.1 v15.88,27.3 | C6.1 v57.36,40.48 | U3.10 U3.11 32.7,44.13 v33.02,43.81 | R3.1 v12.18,70.8 | 65.56,41.59 65.41,41.59 | 66.04,24.13 66.04,24.14 | U2.2 v11.75,43.02 | U5.2 v11.75,52.55 | U4.2 v11.75,33.5 | Q3.2 v15.71,8.57 | v66.02,23.18 66.06,23.23 C8.2 66.06,24.77 66.56,25.26 U1.49 | LED1.C v80.54,65.09 | R36.1 v72.36,59.37 | Q1.2 v73.34,58.18 | C7.2 v72.71,52.07 | R5.1 v84.45,11.4 | C24.1 v58.69,72.82 | v64.39,78.15 C25.1 | C28.1 v69.89,74.3 | R51.1 v63.5,62.75 | R52.1 v64.77,62.75 | R53.1 v66.04,62.75 | R54.1 v67.31,62.75 | R50.1 v55.77,68.9 | R48.1 v69.96,75.56 | R38.1 v40.75,42.86 | R43.2 v88.27,11.32 | R45.2 v74.82,70.48 | R49.1 v55.77,70.17 | R42.2 85.91,37.97 86.68,38.73 J1.1 | R55.2 v60.96,13.36 | R56.1 v63.18,13.36 | C29.2 v21.25,43.5 | R6.1 v77.47,23.62 77.47,23.5 | LED2.C 28.55,2.4 v28.55,1.47 | v26.33,1.47 26.33,2.4 LED3.C | R33.1 v20.95,51.55
  Top 0.254: C5.1 v61.36,42.08
  Top 0.305: C2.- v55.13,46.99
  other vias: 60.33,48.26 58.74,47.94 57.47,47.94 57.15,46.35 57.47,44.45 59.05,44.77 60.64,44.45 62.23,46.35 66.04,48.1 75.56,35.56 75.56,34.29 65.89,43.18 86.04,27.3 63.5,73.03 64.77,73.03 63.5,70.48 64.14,71.75 64.77,70.48 76.52,45.09 68.9,42.86 79.38,43.18 87,53.98 85.72,49.21 63.5,66.67 24.13,33.66 30.48,36.51 49.53,4.13 48.9,1.91 57.78,9.53 80.64,11.11 77.15,7.3 64.45,21.59 64.77,17.14 65.72,33.97 70.8,38.73 72.71,37.47 27.94,26.04 36.2,34.29 53.66,30.16 53.66,18.1 49.85,8.57 40.64,12.06 40.64,14.92 84.45,53.34 72.71,26.04 34.92,28.26 36.83,18.41 38.1,16.83 35.56,11.43 57.78,25.72 82.87,24.45 67.94,16.51 47.62,40.64 51.44,40.64 50.8,41.91 20,63.82 12.7,62.55 20.32,59.69 32.38,49.53
  pour Top (isolate 0.203): 67.06,39.47 67.06,48.26 66.29,49.05 57.43,49.07 56.46,48.16 56.46,44.42 57.38,43.48 64.19,43.48 65.56,42.11 65.56,39.47
  pour Top (isolate 0.203): 73.15,32.38 76.45,32.36 77.04,32.94 79.58,32.97 80.34,33.73 80.34,37.31 79.68,37.97 76.89,37.97 76.15,37.24 76.15,34.24 75.84,33.93 73.15,33.93
  cutout GND: 18.41,33.18 21.75,36.51 26.67,36.51 28.57,38.42 28.57,43.18 30.48,43.18 30.48,37.62 27.46,34.61 22.54,34.61 20.32,32.38 20.32,13.97 22.86,11.43 22.86,-1.91 20.95,-1.91 20.95,10.79 18.41,13.34
  cutout GND: 30.48,47.15 28.57,47.15 28.57,52.4 26.99,53.98 19.37,53.98 16.19,57.15 0.64,57.15 0.64,59.05 16.51,59.05 19.68,55.88 27.94,55.88 30.48,53.34
  pour Bottom: 93.34,94.3 -3.17,94.3 -3.17,81.92 -3.17,-4.45 94.3,-4.45 94.3,94.3
  cutout Top: 22.86,-1.91 20.95,-1.91 20.95,10.79 18.41,13.34 18.41,33.18 21.75,36.51 26.67,36.51 28.57,38.42 28.57,52.39 26.99,53.98 19.37,53.98 16.19,57.15 0.64,57.15 0.64,59.05 16.51,59.05 19.68,55.88 27.94,55.88 30.48,53.34 30.48,38.1 30.48,37.62 27.46,34.61 22.54,34.61 20.32,32.38 20.32,13.97 22.86,11.43
  pour Top: -3.81,-4.13 95.25,-4.13 95.25,0.32 95.25,95.25 85.09,95.25 -3.81,95.25 -3.81,91.44
  pour GND: -1.27,91.76 92.39,91.76 92.39,-1.59 -1.27,-1.59
  cutout Bottom: 20.95,-1.91 20.95,10.79 18.41,13.34 18.41,33.18 21.75,36.51 26.67,36.51 28.57,38.42 28.57,52.39 26.99,53.98 19.37,53.98 16.19,57.15 0.64,57.15 0.64,59.05 16.51,59.05 19.68,55.88 27.94,55.88 30.48,53.34 30.48,37.62 27.46,34.61 22.54,34.61 20.32,32.38 20.32,13.97 22.86,11.43 22.86,-1.91
HMC1053_RESET  (via drill 0.35)
  Top 0.203: Q2.1 13.97,2.86 13.65,3.17 13.65,6.35 13.97,6.67 Q3.1 14.69,7.44 13.9,8.23 13.9,8.91 14.83,9.84 TP1.1 | U1.1 72.06,44.35 72.17,44.46 72.17,45.07 67.08,50.16 36.2,50.16 v34.29,48.26
  Bottom 0.203: TP1.1 18.1,37.78 26.99,46.67 32.7,46.67 v34.29,48.26
MAG_X_FIN  (via drill 0.35)
  Top 0.203: U1.23 58.76,37.41 58.72,37.37 58.12,37.37 57.17,38.31 54.19,38.31 53.08,39.42 47.04,39.42 v43.18,35.56 | J9.10 v40.01,10.48
  Bottom 0.203: v43.18,35.56 43.18,34.92 36.28,28.03 36.28,20.15 39.91,16.53 39.91,11.53 40.01,11.43 v40.01,10.48
MAG_X_RIN  (via drill 0.35)
  Top 0.203: v45.09,36.2 47.98,39.09 52.95,39.09 54.05,37.98 57.03,37.98 58.11,36.91 U1.24 | J9.12 41.27,10.79 v41.3,10.77
  Bottom 0.203: v45.09,36.2 36.62,27.73 36.62,20.29 41.37,15.53 41.37,11.76 41.3,11.69 v41.3,10.77
MAG_Y_FIN
  Top 0.203: U1.29 60.02,34.41 59.35,35.08 55.96,35.08 54.29,36.75 53.89,36.75 52.54,38.1 50.03,38.1 45.23,33.3 40.28,33.3 36.28,29.3 36.28,20.15 37.56,18.87 37.56,18.11 37.47,18.01 37.47,17.23 37.37,17.13 37.37,16.52 37.47,16.43 J9.6
MAG_Y_RIN
  Top 0.203: U1.30 60.63,33.95 59.69,33.95 58.9,34.74 55.83,34.74 54.16,36.41 53.75,36.41 52.4,37.77 50.16,37.77 45.36,32.97 40.42,32.97 36.62,29.16 36.62,20.29 38.73,18.17 38.73,17.23 38.83,17.13 38.83,16.52 38.73,16.43 J9.8
MAG_Z_FIN
  Top 0.203: U1.25 58.14,36.41 56.89,37.65 53.92,37.65 52.81,38.76 49.76,38.76 44.95,33.96 40.01,33.96 35.04,28.99 34.62,28.99 34.56,28.93 | J9.2 34.92,11.03 34.83,11.13 34.83,11.73 34.92,11.83 34.92,27.22 34.19,27.95 34.19,28.56 34.56,28.93 | 34.56,28.93
MAG_Z_RIN
  Top 0.203: 60.71,35.88 U1.26 58.16,35.91 56.74,37.32 53.78,37.32 52.67,38.43 49.89,38.43 45.09,33.63 40.15,33.63 35.95,29.44 35.95,27.94 35.95,20.01 36.2,19.77 36.2,18.82 36.1,18.72 36.1,18.11 36.2,18.01 36.2,11.83 36.29,11.73 36.29,11.13 36.2,11.03 J9.4
MSP430_ACTIVE  (via drill 0.35)
  Top 0.203: U1.77 75.14,36.91 75.63,37.4 75.63,38.8 77.36,40.53 81.8,40.53 v86.36,45.09 | R8.1 83.19,63.5 83.7,62.98 83.7,62.87 | 83.82,61.59 J11.10 83.7,62.87 | v85.09,62.87 83.7,62.87
  Bottom 0.203: v85.09,62.87 85.93,62.02 85.93,50.36 86.46,49.83 86.46,48.59 86.36,48.49 v86.36,45.09
MSP_OBC_RESET
  Top 0.203: Q1.1 75.25,59.27 R36.2 76.73,60.96 85.2,60.96 85.72,60.44 85.72,59.37 86.04,59.05 J11.5
N$4
  Top 0.203: R8.2 77.57,64.45 77.67,64.55 LED1.A
N$5
  Top 0.203: LED2.A R31.2
N$6
  Top 0.203: LED3.A R32.2
N$7
  Top 0.203: U6.4 63.88,74.55 63.18,75.25 R30.1
N$8  (via drill 0.35)
  other vias: 77.15,32.7
N$9
  Top 0.203: Q2.3 Q3.3 12.62,8.65 TP6.1 9.84,11.43 C18.1
N$10  (via drill 0.35)
  other vias: 68.58,66.67
N$11  (via drill 0.35)
  other vias: 68.58,65.09
N$12  (via drill 0.35)
  other vias: 68.58,63.5
N$13
  Top 0.203: C24.2 61.93,72.82 62.24,72.5 U6.9
N$14  (1 unrouted)
  Top 0.203: 70.95,71.31 70.95,72.24 70.19,73 U6.27
  Top 0.254: Y3.P1 72.39,69.67 C26.2
N$15  (1 unrouted)
  Top 0.203: 70.02,71.31 70.02,71.91 69.42,72.5 U6.26
  Top 0.254: C27.2 68.58,69.67 Y3.P2
N$16
  Top 0.203: U6.7 62.18,73.5 61.78,73.9 61.78,79.51 J2.1
N$17
  Top 0.203: U6.8 62.21,73 61.45,73.77 61.45,77.3 J2.2
N$20
  Top 0.203: R10.2 R11.1 8.04,41.81 8.26,41.59 8.26,40.32 8.47,40.11 R14.1
N$21
  Top 0.203: R13.1 C17.1 | C17.1 12.46,44.23 U2.3 | R15.2 C17.1
N$22  (via drill 0.35)
  other vias: 70.48,62.87
N$23
  Top 0.203: R12.1 10.48,41.81 | 10.48,41.81 R14.2 | U2.1 11.05,44.13 10.79,44.13 10.48,43.81 10.48,41.81
N$24  (via drill 0.35)
  other vias: 72.39,63.5
N$25  (via drill 0.35)
  other vias: 72.07,65.41
N$26  (via drill 0.35)
  other vias: 72.39,66.67
N$27  (via drill 0.35)
  other vias: 68.58,71.44
N$28  (via drill 0.35)
  other vias: 72.07,71.12
N$29
  Top 0.203: U3.2 25.08,46.67 24.77,46.99 TP5.1 22.75,46.99 20.95,48.78 R33.2
N$30
  Top 0.203: U3.13 35.56,45.4 38.1,42.86 R38.2
N$31
  Top 0.203: U3.7 C29.1 23.23,42.7 21.74,42.7 21.27,42.23 R37.2
N$32
  Top 0.203: J1.2 86.68,36.2 85.91,36.97 R42.1
N$33
  Top 0.203: R43.1 J1.10
N$34
  Top 0.203: U1.67 75.95,31.91 76.1,31.75 R46.1
N$35
  Top 0.203: C18.2 TP8.1 R16.1
N$36  (via drill 0.35)
  Top 0.203: R19.2 v14.29,24.13 | v12.6,24.13 U7.7 10.33,24.13 6.99,20.79 U7.2
  Bottom 0.203: v14.29,24.13 v12.6,24.13
N$37
  Top 0.203: R16.2 TP7.1 U7.3 8.26,21.59 9.53,22.86 U7.6
N$38
  Top 0.203: U1.66 75.56,31.41 75.71,31.26 77.33,31.26 78.11,30.48 R47.1
N$39
  Top 0.203: Q2.2 C10.2 16.61,6.88 R9.1
N$40
  Top 0.203: U6.1 65.7,74.61 65.72,74.61 66.67,75.56 R48.2
N$42
  Top 0.203: R49.2 58.1,70.17 58.94,71 U6.12
N$43
  Top 0.203: R50.2 57.78,68.9 59.39,70.5 U6.13
N$44
  Top 0.203: R51.2 63.5,65.27 66.66,68.43 66.66,69.84 66.5,70 U6.21
N$45
  Top 0.203: U6.22 66.46,70.5 66.99,69.97 66.99,68.26 64.77,66.04 R52.2
N$46
  Top 0.203: R53.2 66.04,66.67 67.32,67.96 67.32,70.11 66.43,71 U6.23
N$47
  Top 0.203: R54.2 67.31,67.48 67.65,67.82 67.65,70.25 66.4,71.5 U6.24
N$49
  Top 0.203: R17.2 R18.1 | R18.1 7.41,32.28 | R18.1 8.04,32.28 8.26,32.07 8.26,30.8 8.47,30.58 R22.1
N$50
  Top 0.203: R23.2 C21.1 | C21.1 R21.1 | C21.1 12.46,34.71 U4.3
N$52
  Top 0.203: R20.1 10.48,32.28 | 10.48,32.28 R22.2 | U4.1 11.05,34.61 10.79,34.61 10.48,34.29 10.48,32.28
N$55
  Top 0.203: 55.99,3.81 J8.9 58.39,3.69 58.72,4.03 63.18,8.49 63.18,9.21 R56.2
N$57  (via drill 0.35)
  Top 0.203: R55.1 60.96,8.26 60.33,7.62 v59.69,7.62 | v56.83,7.62 55.99,7.62 J8.10
  Bottom 0.203: v59.69,7.62 v56.83,7.62
N$58
  Top 0.203: R45.1 78.11,70.48 81.92,74.3 J3.8
N$59
  Top 0.203: R24.2 R25.1 8.04,51.33 8.26,51.12 8.26,49.85 8.47,49.63 R28.1
N$60
  Top 0.203: C23.1 R29.2 | C23.1 R27.1 | C23.1 14.23,53.7 U5.3
N$62
  Top 0.203: R26.1 10.48,51.33 | 10.48,51.33 R28.2 | U5.1 11.05,53.66 10.79,53.66 10.48,53.34 10.48,51.33
OUT_A_N  (via drill 0.35)
  Top 0.203: TP13.1 R12.2 | U7.10 8.26,28.36 v8.79,28.89
  Bottom 0.203: TP13.1 11.75,35.88 10.89,35.02 10.89,31 v8.79,28.89
OUT_A_P  (via drill 0.35)
  Top 0.203: R13.2 TP12.1 | v6.99,22.54 6.03,21.59 U7.16
  Bottom 0.203: v6.99,22.54 9.49,25.04 12.53,25.04 15.1,27.61 15.1,37.61 TP12.1
OUT_B_N
  Top 0.203: R20.2 TP15.1 11.75,27.3 13.34,25.72 13.34,21.59 12.06,20.32 9.62,20.32 U7.4
OUT_B_P  (via drill 0.35)
  Top 0.203: TP14.1 R21.2 | U7.12 5.71,25.72 6.03,25.4 v6.35,25.4
  Bottom 0.203: TP14.1 14.29,27.3 12.38,25.4 v6.35,25.4
OUT_C_N  (via drill 0.35)
  Top 0.203: TP17.1 R26.2 | U7.9 9.53,28.89 10.16,29.53 v10.16,31.43
  Bottom 0.203: TP17.1 10.79,46.99 10.16,46.35 v10.16,31.43
OUT_C_P  (via drill 0.35)
  Top 0.203: TP16.1 R27.2 | U7.13 4.34,27.2 v4.76,27.62
  Bottom 0.203: TP16.1 14.29,43.5 12.7,41.91 12.7,31.11 9.53,27.94 5.08,27.94 v4.76,27.62
P1.0  (via drill 0.35)
  Top 0.203: v62.87,14.92 60.33,17.46 v60.33,27.3 | U1.21 58.73,38.41 v58.42,38.1
  Bottom 0.203: v62.87,14.92 65.41,12.38 65.41,5.08 JP1.1 | v58.42,38.1 58.42,34.92 59.38,33.96 59.38,29.84 60.33,28.91 v60.33,27.3
P1.1  (via drill 0.35)
  Top 0.203: v64.45,14.92 61.59,17.78 v61.59,26.04 | v61.91,36.83 61.91,37.65 61.66,37.91 U1.22
  Bottom 0.203: v64.45,14.92 66.99,12.38 66.99,4.76 67.94,3.81 69.22,3.81 JP1.2 | v61.91,36.83 61.91,35.65 61.18,34.91 61.18,34.3 61.47,34.01 61.47,30.69 61.59,30.56 v61.59,26.04
P1.7/CTS  (via drill 0.35)
  Top 0.203: U1.28 61.62,34.91 v61.91,34.61 | v66.67,29.21 72.01,29.21 73.39,27.83 85.53,27.83 86.28,28.57 J1.5
  Bottom 0.203: v61.91,34.61 61.91,32.3 61.8,32.19 61.8,30.82 63.51,29.11 64.35,29.11 64.45,29.21 v66.67,29.21
P2.3  (via drill 0.35)
  Top 0.203: U1.32 60.63,32.86 57.55,32.86 55.15,30.45 55.15,25.5 56.52,24.13 v57.88,24.13 | v66.04,20.32 v66.04,15.85
  Bottom 0.203: v57.88,24.13 60.33,24.13 61.28,23.18 63.9,23.18 66.04,21.04 v66.04,20.32 | JP1.3 73.03,8.86 v66.04,15.85
P4.4/UCA1TXD
  Top 0.203: U1.51 67.56,25.23 70.36,22.43 74.1,22.43 74.22,22.55 78.67,22.55 79.61,23.5 J1.7
P4.5/UCA1RXD
  Top 0.203: U1.52 68.06,25.2 70.5,22.76 73.96,22.76 74.09,22.89 78.53,22.89 81.68,26.04 J1.6
P5.2/XT2IN1
  Top 0.203: Y2.3 77.14,33.98 76.06,32.91 U1.69
P5.3/XT2OUT1
  Top 0.203: Y2.1 77.24,36.98 76.68,36.42 76.68,34.24 75.84,33.4 U1.70
P5.4/XIN1
  Top 0.203: C3.2 63.75,48.08 Y1.P2 65.72,46.83 66.12,46.43 66.12,43.94 66.56,43.5 U1.12
P5.5/XOUT1
  Top 0.203: C4.2 63.76,44.64 Y1.P1 65.2,45.69 65.2,42.77 66.06,41.91 U1.13
P6.7/RTS  (via drill 0.35)
  Top 0.203: v69.43,37.57 69.43,38.42 70.56,39.54 U1.4 | v69.43,34.3 69.43,32.25 73.53,28.16 85.31,28.16 J1.4
  Bottom 0.203: v69.43,37.57 v69.43,34.3
RESERVED_1  (via drill 0.35)
  Top 0.203: U1.31 58.67,33.41 v58.42,33.66 | v77.37,57.15 79.28,59.05 J11.6
  Bottom 0.203: v58.42,33.66 57.78,34.29 57.78,37.17 53.67,41.28 53.67,48.12 59.73,54.18 60.13,54.18 62.13,56.19 76.41,56.19 v77.37,57.15
RESERVED_2  (via drill 0.35)
  Top 0.203: U1.35 59.08,31.41 58.79,31.11 v57.78,31.11 | v77.37,59.05 78.64,60.33 J11.8
  Bottom 0.203: v57.78,31.11 57.38,31.52 57.38,37.1 53.34,41.15 53.34,48.26 59.59,54.51 59.99,54.51 62,56.52 74.83,56.52 v77.37,59.05
RST/SBWTDIO  (via drill 0.35)
  Top 0.203: Q1.3 74.3,54.61 74.8,54.11 R7.1 74.8,52.22 C7.1 74.94,51.53 71.34,47.93 71.34,47 74.57,43.77 v74.57,42.27 | U1.76 75.14,36.41 75.96,37.23 75.96,37.55 v76.52,38.1 79.96,38.1 80.08,37.99 80.12,37.99 85.72,32.38 88.57,32.38 89.38,31.57 89.38,22.07 J1.8 87.15,19.84 87.15,15.41 85.13,13.38 83.88,13.38 83.24,12.74 83.24,12.01 76.58,5.36 S1.1 S1.2
  Bottom 0.203: v74.57,42.27 76.52,40.32 v76.52,38.1
RW_X_DIR  (via drill 0.35)
  Top 0.203: J9.7 38.73,1.91 39.45,1.19 45.72,1.19 47.94,3.42 v47.94,4.76 | U1.75 72.78,35.91 72.17,36.51 v71.44,36.51
  Bottom 0.203: v71.44,36.51 71.12,36.2 70.8,35.88 70.8,34.09 70.79,34.07 71.22,33.64 71.22,33.03 71.12,32.94 71.12,25.64 72.5,24.25 72.5,23.37 72.1,22.97 72.1,20.36 70.17,18.43 64.28,18.43 56,10.15 56,9.58 53.5,7.08 49.69,7.08 47.94,5.33 v47.94,4.76
RW_X_OUTFG  (via drill 0.35)
  Top 0.203: J9.13 42.66,3.81 v44.77,3.81 | v71.44,23.81 71.44,24.45 70.56,25.32 U1.57
  Bottom 0.203: v71.44,23.81 71.44,20.64 69.89,19.09 64,19.09 55.34,10.43 55.34,9.86 53.22,7.74 49.33,7.74 48.93,7.34 45.4,3.81 v44.77,3.81
RW_X_SPEED_CTRL  (via drill 0.35)
  Top 0.203: J9.1 34.92,4.76 v35.88,5.71 | U1.42 63.06,26 62.53,25.48 62.53,22.24 v62.55,22.23 | v54.95,17.78 54.93,17.78 55.56,18.41 v57.15,18.41
  Bottom 0.203: v35.88,5.71 36.51,6.35 43.04,6.35 43.81,7.12 46.22,7.12 49.79,10.7 52.87,10.7 54.95,12.79 v54.95,17.78 | v62.55,22.23 58.74,18.41 v57.15,18.41
RW_Y_DIR  (via drill 0.35)
  Top 0.203: J9.9 40.01,1.91 40.39,1.52 44.7,1.52 v46.35,3.17 | v72.07,35.24 72.23,35.41 U1.74
  Bottom 0.203: v72.07,35.24 71.75,34.92 71.75,33.74 71.66,33.64 71.66,33.03 71.75,32.94 71.75,25.47 72.83,24.39 72.83,23.23 72.43,22.83 72.43,20.22 70.3,18.1 64.42,18.1 56.33,10.02 56.33,9.45 53.63,6.75 49.82,6.75 48.68,5.6 48.68,4.46 48.03,3.81 46.99,3.81 v46.35,3.17
RW_Y_OUTFG  (via drill 0.35)
  Top 0.203: J8.1 50.8,1.91 51.44,1.27 57.47,1.27 70.17,13.97 v70.17,20.64 | v70.17,24.45 70.17,25.08 70.06,25.19 U1.56
  Bottom 0.203: v70.17,24.45 v70.17,20.64
RW_Y_SPEED_CTRL  (via drill 0.35)
  Top 0.203: U1.33 57.57,32.41 55.88,30.71 v55.88,26.04 | J9.3 36.2,4.76 36.81,5.38 37.6,5.38 38.1,5.87 43.66,5.87 v44.13,6.35
  Bottom 0.203: v44.13,6.35 45.91,6.35 49.93,10.37 53,10.37 55.29,12.65 55.29,17.08 55.88,17.67 v55.88,26.04
RW_Z_DIR  (via drill 0.35)
  Top 0.203: v44.48,2.54 44.45,2.54 43.76,1.85 41.64,1.85 41.27,2.22 J9.11 | U1.73 73.92,34.92 73.03,34.92 72.17,34.07 71.22,34.07 v70.48,33.34
  Bottom 0.203: v70.48,33.34 70.48,25.8 72.17,24.12 72.17,23.51 71.77,23.11 71.77,20.5 70.03,18.76 64.14,18.76 55.67,10.29 55.67,9.72 53.36,7.41 49.55,7.41 45.22,3.08 45.01,3.08 v44.48,2.54
RW_Z_OUTFG  (via drill 0.35)
  Top 0.203: v54.61,10.16 53.98,9.53 51.44,9.53 50.8,8.89 J8.2 | U1.43 63.56,24.59 63.4,24.43 63.4,20.86 v62.87,20.32
  Bottom 0.203: v54.61,10.16 62.87,18.41 v62.87,20.32
RW_Z_SPEED_CTRL  (via drill 0.35)
  Top 0.203: v57.15,26.67 57.15,27.54 56.42,28.27 56.42,30.78 57.54,31.91 U1.34 | J9.5 37.47,4.59 38.42,5.54 43.99,5.54 44.13,5.4 v45.09,5.4
  Bottom 0.203: v57.15,26.67 57.15,25.4 56.21,24.46 56.21,17.53 55.62,16.94 55.62,12.52 53.14,10.04 50.27,10.04 45.63,5.4 v45.09,5.4
TARGET_PUR  (via drill 0.35)
  Top 0.203: v76.2,29.84 76.14,29.91 U1.63 | R6.2 v77.47,27.09 77.47,27.3
  Bottom 0.203: v77.47,27.09 77.47,28.57 v76.2,29.84
TB0.3  (via drill 0.35)
  Top 0.203: U1.58 71.06,25.46 73.03,23.5 v73.66,23.5
  Bottom 0.203: v73.66,23.5 73.66,18.41 72.69,17.45 72.69,9.91 75.75,6.85 75.75,4.92 75.56,4.73 JP1.4
TB0.4  (via drill 0.35)
  Top 0.203: U1.59 71.56,25.59 72.39,24.77 v73.98,24.77
  Bottom 0.203: v73.98,24.77 74.39,24.35 74.39,23.19 73.99,22.79 73.99,18.28 73.02,17.31 73.02,10.04 78.11,4.96 JP1.5
TEST/SBWTCK  (via drill 0.35)
  Top 0.203: U1.71 72.96,33.91 v72.39,33.34
  Bottom 0.203: J1.9 81.61,18.41 72.39,27.63 v72.39,33.34
UCA0RXD
  Top 0.203: U1.41 62.56,27.94 63.2,28.57 64.14,28.57 65.94,30.38 65.94,32.14 79,45.2 83.19,45.2 87,49.01 J4.2 87.75,51.55 J11.1
UCA0TXD
  Top 0.203: J11.3 86.68,57.78 85.72,56.83 85.72,52.07 J4.1 84.45,46.99 83.03,45.56 78.9,45.56 65.61,32.27 65.61,30.6 63.91,28.91 U1.40
UCB0_SPI_CLK  (via drill 0.35)
  Top 0.203: J8.4 52.07,6.67 53.01,5.72 56.47,5.72 59.44,8.7 59.44,29.13 59.72,29.41 U1.39 63.38,29.41 v63.82,29.84 64.55,30.58 64.55,36.63 61.66,39.52 54.39,39.52 49.65,44.26 38.29,44.26 35.24,47.31 U3.16 | v85.09,68.58 85.72,69.22 85.72,71.87 86.25,72.39 87.11,72.39 J3.5 86.88,73.03
  Bottom 0.203: v63.82,29.84 62.65,31.02 62.56,31.02 62.13,31.45 62.13,32.05 62.35,32.28 62.35,32.9 73.3,43.84 73.37,43.84 78.74,49.21 JP4.5 82.03,50.28 82.03,65.52 v85.09,68.58
UCB0_SPI_MISO  (via drill 0.35)
  Top 0.203: J8.6 53.34,6.67 53.95,6.05 56.33,6.05 59.11,8.83 59.11,29.43 59.53,29.86 60.63,29.86 U1.38 62.29,29.91 63.82,31.43 v63.82,32.7 63.82,36.89 61.52,39.19 54.25,39.19 53.36,40.08 53.34,40.08 52.15,41.27 v45.72,41.27 | J3.1 87.75,69.33 v87.63,69.22 | v43.18,41.27 39.07,41.27 35.58,44.77 U3.12
  Bottom 0.203: v87.63,69.22 87.63,68.58 82.69,63.64 82.69,50 82.56,49.88 82.56,43.19 JP4.2 79.69,41.59 78.11,43.18 73.58,43.18 63.82,33.42 v63.82,32.7 | v43.18,41.27 v45.72,41.27
UCB0_SPI_MOSI  (via drill 0.35)
  Top 0.203: J8.8 54.61,8.69 58.78,12.86 58.78,29.57 59.62,30.41 U1.37 62.23,30.41 62.87,31.05 v62.87,31.75 62.87,37.38 61.39,38.86 54.11,38.86 53.22,39.75 45.9,39.75 42.05,43.6 38,43.6 35.56,46.04 U3.14 | v84.45,66.67 86.06,68.28 86.06,70.94 86.88,71.75 J3.3
  Bottom 0.203: v62.87,31.75 62.87,32.94 73.44,43.51 78.11,43.51 78.73,44.13 JP4.3 82.23,45.4 82.23,50.02 82.36,50.14 82.36,64.58 v84.45,66.67
UCB1_I2C_SCL  (via drill 0.35)  (1 unrouted)
  Top 0.203: U6.19 64.89,68.84 64.63,68.59 62.8,68.59 60.64,66.43 R40.1 60.19,64.64 59.91,64.35 59.91,62.45 60.64,61.72 60.64,57.78 v59.69,56.83 | U1.47 65.56,25.55 v64.14,24.13
  Bottom 0.203: v59.69,56.83 52.68,49.82 52.68,40.87 56.72,36.83 56.72,30.44 58.73,28.44 58.73,27.4 61.99,24.13 v64.14,24.13
UCB1_I2C_SDA  (via drill 0.35)
  Top 0.203: U1.46 65.06,26.32 v64.45,25.72 | U6.20 65.7,68.56 65.09,67.94 63.5,67.94 61.91,66.36 R39.1 62.37,64.64 62.65,64.35 62.65,62.33 61.91,61.59 TP19.1 61.91,57.47 v59.69,55.24
  Bottom 0.203: v64.45,25.72 64.04,25.3 61.29,25.3 59.05,27.54 59.05,28.57 57.05,30.58 57.05,36.97 53.01,41.01 53.01,48.56 v59.69,55.24
VCORE1
  Top 0.254: U1.20 62.23,40.28
  Top 0.305: C6.2 61.76,40.48 61.95,40.28 62.23,40.28
Z-_SUN_3V_PRESENT
  Top 0.203: J11.9 87.75,62.34 89.76,64.36 89.76,76.15 88.66,77.25 87.09,77.25 85.41,75.56 J3.10

## Text on the board
tPlace: ADCS MOTHERBOARD REV B | Designer: Thomas Christison | Dalhousie Space Systems Lab | U5 | U2 | U4 | +5V | +3V3 | GND | POWER | TX | RX | GND | 3V3 | RTS>> | CTS<< | RXD<< | TXD>> | +Y | +X | SBWRST | SBWTST | +5V | +3V3